# Altium schematic sheet CONDITIONING.SchDoc
size A4; DrawnBy: Copyright © 2023 by; Engineer: Artyom Kislevitz Lee; Revision: A
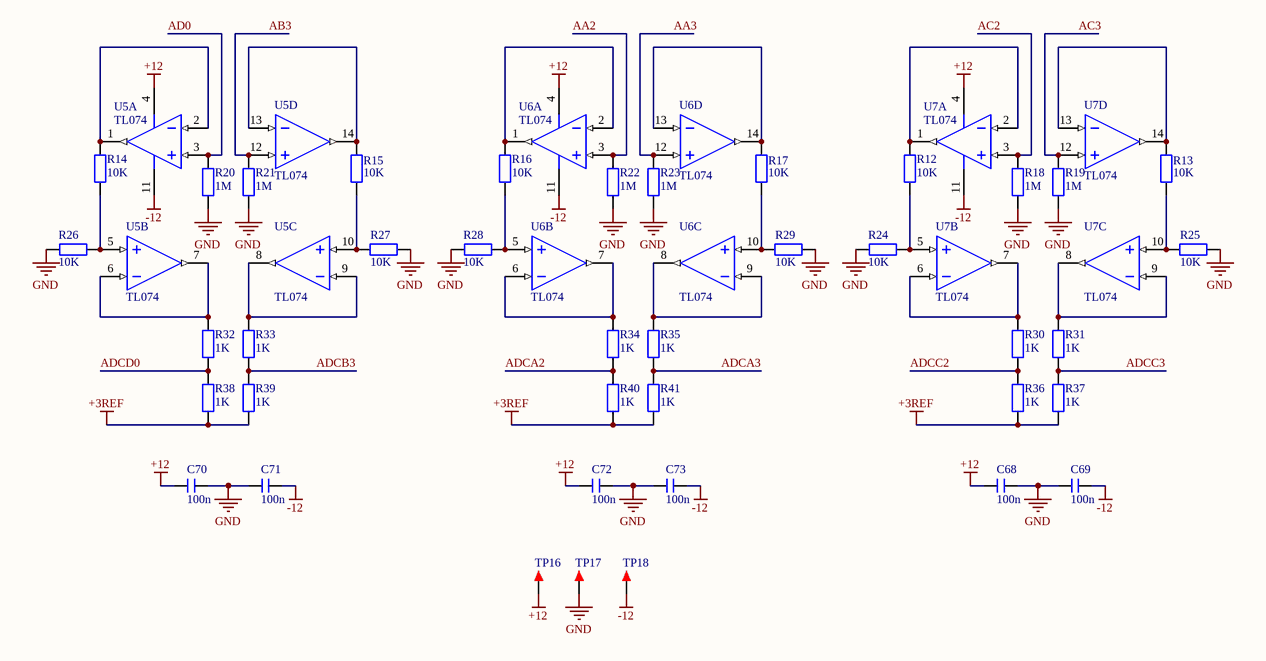
[diagram p0: CONDITIONING.SchDoc]

## Parts
C68  100n  [C 0805_L]
C69  100n  [C 0805_L]
C70  100n  [C 0805_L]
C71  100n  [C 0805_L]
C72  100n  [C 0805_L]
C73  100n  [C 0805_L]
R12  10K  [R 0805_L]
R13  10K  [R 0805_L]
R14  10K  [R 0805_L]
R15  10K  [R 0805_L]
R16  10K  [R 0805_L]
R17  10K  [R 0805_L]
R18  1M  [R 0805_L]
R19  1M  [R 0805_L]
R20  1M  [R 0805_L]
R21  1M  [R 0805_L]
R22  1M  [R 0805_L]
R23  1M  [R 0805_L]
R24  10K  [R 0805_L]
R25  10K  [R 0805_L]
R26  10K  [R 0805_L]
R27  10K  [R 0805_L]
R28  10K  [R 0805_L]
R29  10K  [R 0805_L]
R30  1K  [R 0805_L]
R31  1K  [R 0805_L]
R32  1K  [R 0805_L]
R33  1K  [R 0805_L]
R34  1K  [R 0805_L]
R35  1K  [R 0805_L]
R36  1K  [R 0805_L]
R37  1K  [R 0805_L]
R38  1K  [R 0805_L]
R39  1K  [R 0805_L]
R40  1K  [R 0805_L]
R41  1K  [R 0805_L]
TP16  TEST  [TEST 1]  (value not drawn)
TP17  TEST  [TEST 1]  (value not drawn)
TP18  TEST  [TEST 1]  (value not drawn)
U5  TL074  [SOP14_N]  (parts A,B,C,D of 4)
U6  TL074  [SOP14_N]  (parts A,B,C,D of 4)
U7  TL074  [SOP14_N]  (parts A,B,C,D of 4)

## Nets
+3REF: R36.1 R37.1 R38.1 R39.1 R40.1 R41.1
+12: C68.1 C70.1 C72.1 TP16.1 U5.4(VCC+) U6.4(VCC+) U7.4(VCC+)
-12: C69.2 C71.2 C73.2 TP18.1 U5.11(VCC-) U6.11(VCC-) U7.11(VCC-)
GND: C68.2 C69.1 C70.2 C71.1 C72.2 C73.1 R18.1 R19.1 R20.1 R21.1 R22.1 R23.1 R24.1 R25.1 R26.1 R27.1 R28.1 R29.1 TP17.1
AA2: R22.2 U6.3(IN1+)
AA3: R23.2 U6.12(IN3+)
AB3: R21.2 U5.12(IN3+)
AC2: R18.2 U7.3(IN1+)
AC3: R19.2 U7.12(IN3+)
AD0: R20.2 U5.3(IN1+)
ADCA2: R34.1 R40.2
ADCA3: R35.1 R41.2
ADCB3: R33.1 R39.2
ADCC2: R30.1 R36.2
ADCC3: R31.1 R37.2
ADCD0: R32.1 R38.2
NetR12_1: R12.1 R24.2 U7.5(IN2+)
NetR12_2: R12.2 U7.1(OUT) U7.2(IN1-)
NetR13_1: R13.1 R25.2 U7.10(IN4+)
NetR13_2: R13.2 U7.13(IN3-) U7.14(OUT)
NetR14_1: R14.1 R26.2 U5.5(IN2+)
NetR14_2: R14.2 U5.1(OUT) U5.2(IN1-)
NetR15_1: R15.1 R27.2 U5.10(IN4+)
NetR15_2: R15.2 U5.13(IN3-) U5.14(OUT)
NetR16_1: R16.1 R28.2 U6.5(IN2+)
NetR16_2: R16.2 U6.1(OUT) U6.2(IN1-)
NetR17_1: R17.1 R29.2 U6.10(IN4+)
NetR17_2: R17.2 U6.13(IN3-) U6.14(OUT)
NetR30_2: R30.2 U7.6(IN2-) U7.7(OUT)
NetR31_2: R31.2 U7.8(OUT) U7.9(IN4-)
NetR32_2: R32.2 U5.6(IN2-) U5.7(OUT)
NetR33_2: R33.2 U5.8(OUT) U5.9(IN4-)
NetR34_2: R34.2 U6.6(IN2-) U6.7(OUT)
NetR35_2: R35.2 U6.8(OUT) U6.9(IN4-)

## Notes on the sheet
- Project
- Title
- Size:
- Date:
- A4
- Number:
- Time:
- Revision:
- Sheet
- of
- Copyright © 2023 by
- Artyom Kislevitz Lee
- File:

## Library data of the parts
C68-C73 = C: 贴片电容; 淘宝ID: 小糖豆的小窝窝; BOM名称: 贴片电容; 下单链接: https://item.taobao.com/item.htm?ft=t&id=613637044352
R12-R41 = R: 贴片电阻; 淘宝ID: 小糖豆的小窝窝; BOM名称: 贴片电阻; 下单链接: https://item.taobao.com/item.htm?ft=t&id=613637044352
TP16-TP18 = TEST: 测试点; 淘宝ID: 小糖豆的小窝窝; BOM名称: 测试点; 下单链接: https://item.taobao.com/item.htm?ft=t&id=613637044352
U5-U7 = TL074: Low Noise JFET-Input Operational Amplifiers; 淘宝ID: 小糖豆的小窝窝; Alias1: https://item.taobao.com/item.htm?ft=t&id=613637044352; BOM名称: Low Noise JFET-Input Operational Amplifiers